# EasyEDA Pro project ProPrj_MN42_2025-04-09.epro, schematic btnBRD
Board Name: btnBRD; Create Date: 2025-04-03; Page Name: btnBRD; Project Name: MN42; Schematic Name: btnBRD; Update Date: 2025-04-05; File: btnBRD; Id: /; Sheet: /
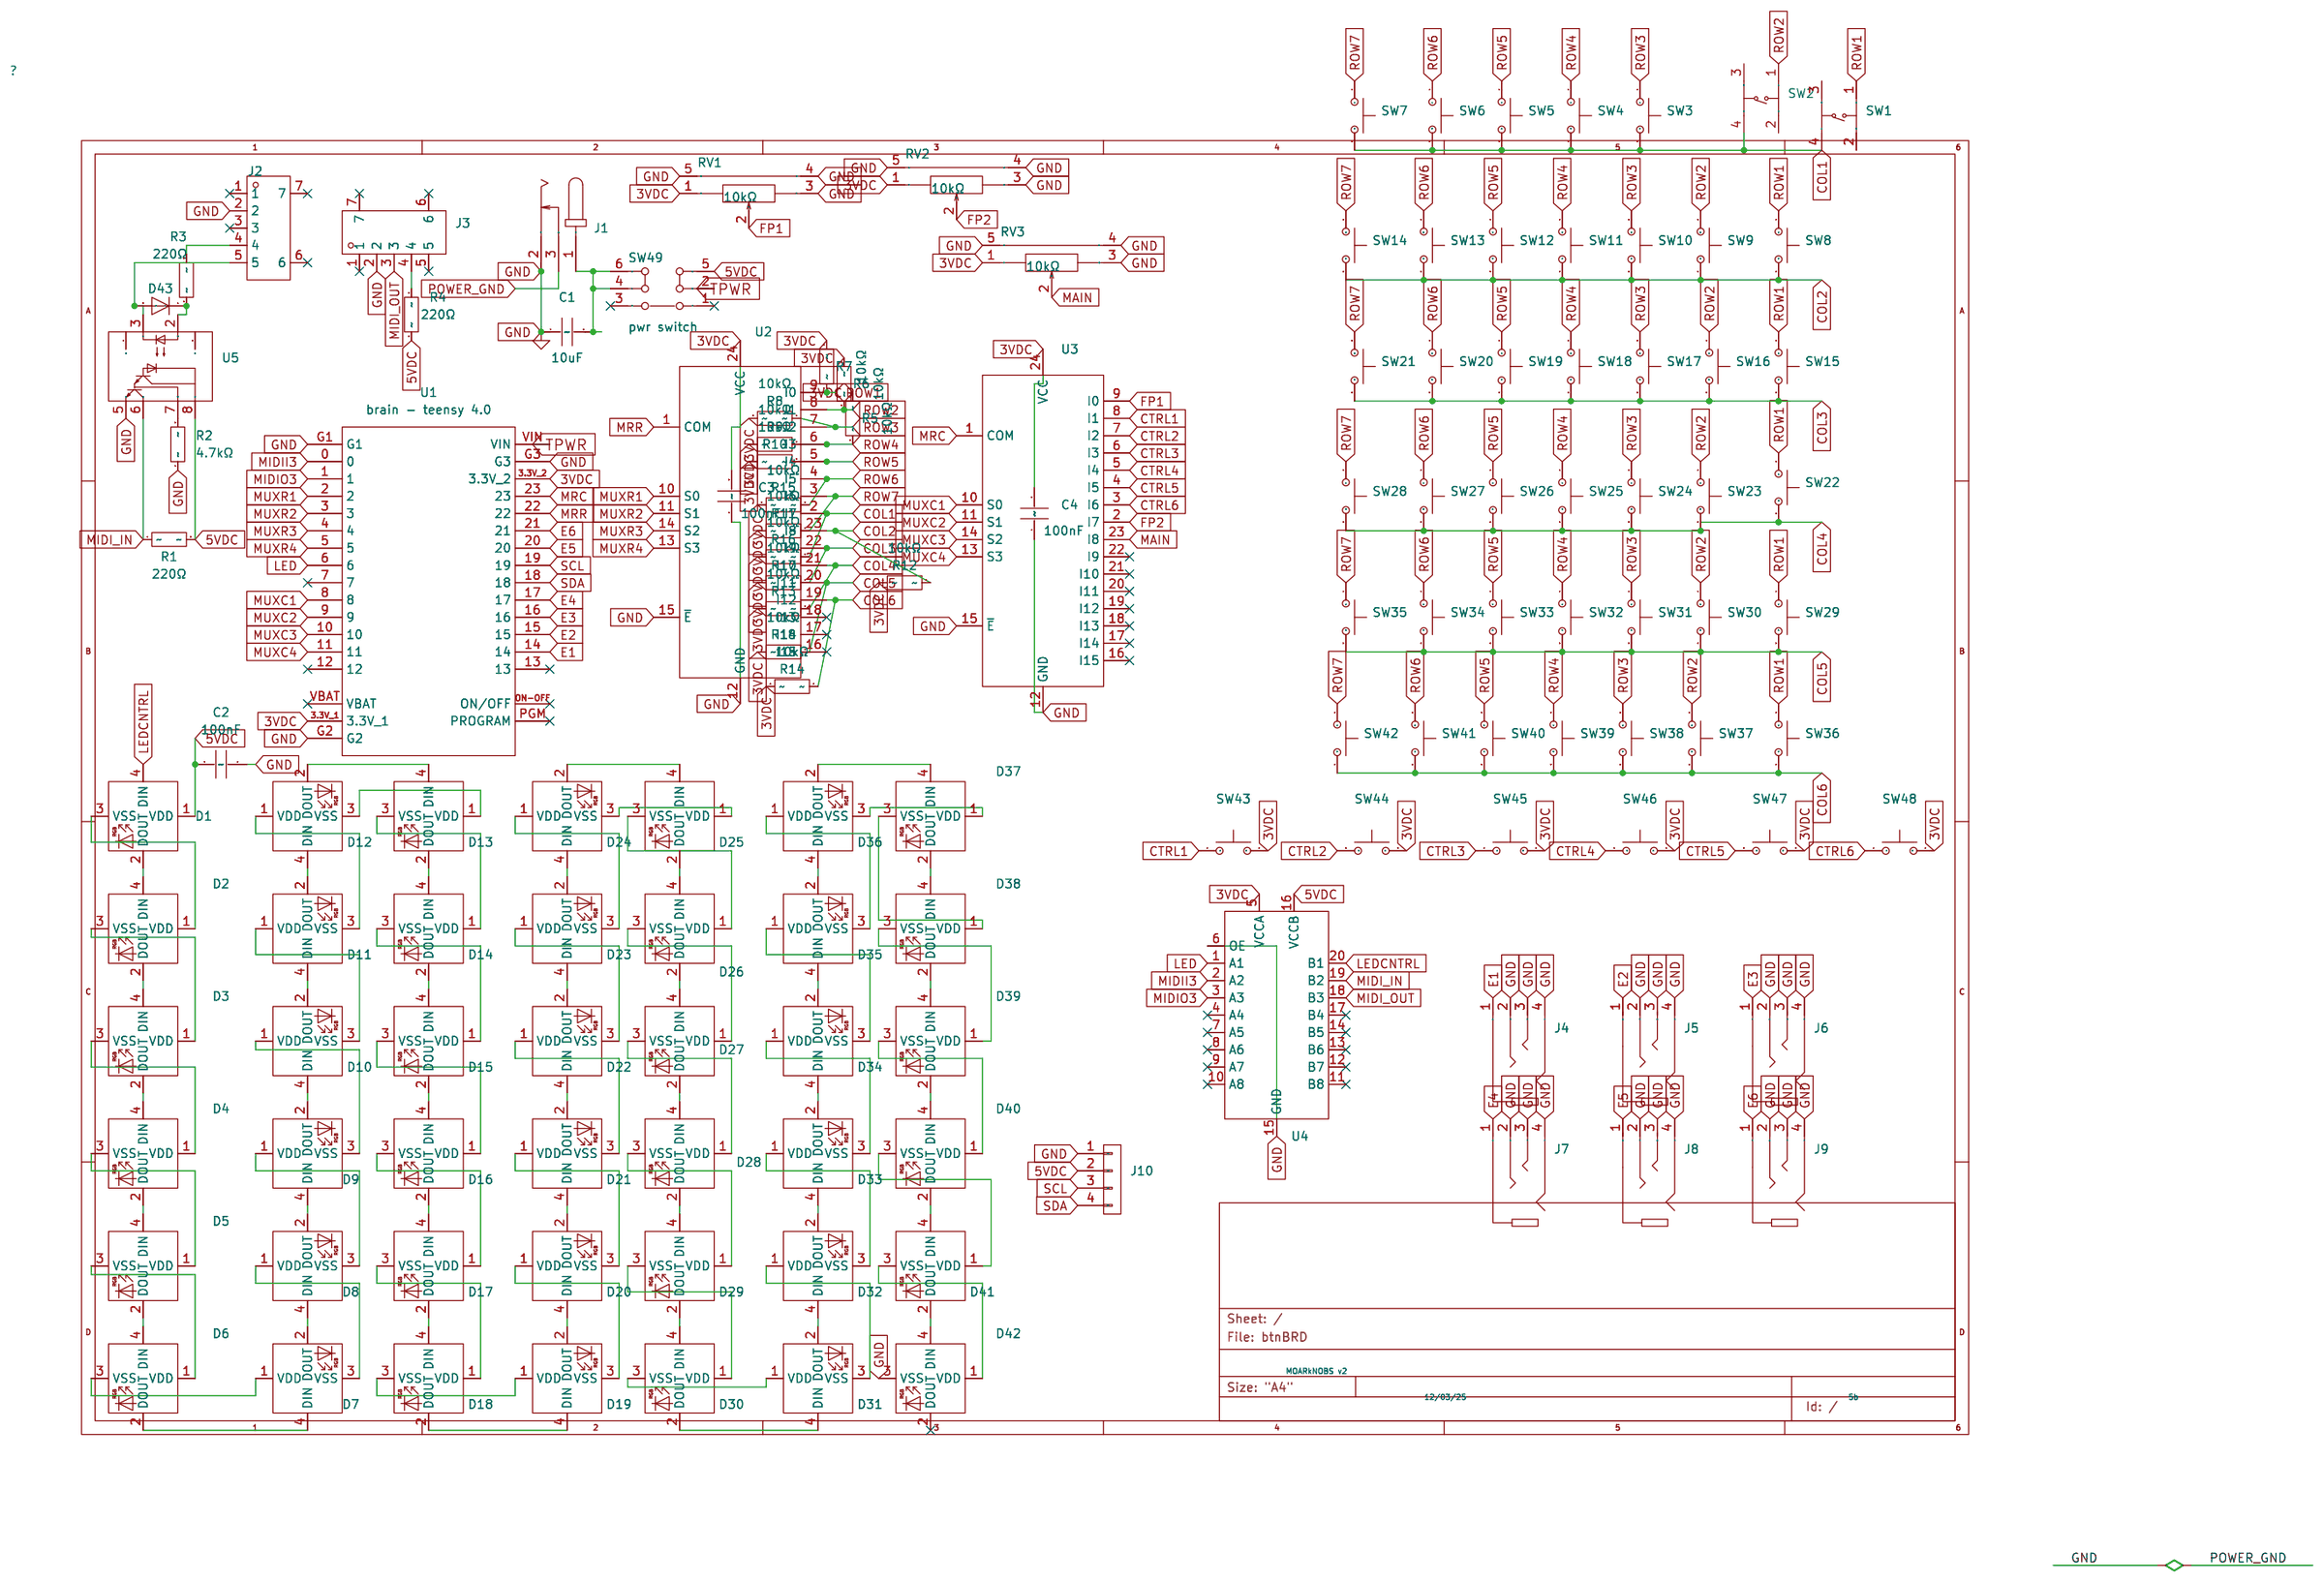
[diagram p0: schematic sheet]

## Parts
C1  10uF  [CAP-TH_L5.5-W3.5-P5.00-D0.5]
C2  100nF  [CAP-TH_L5.0-W4.0-P5.00-D1.0]
C3  100nF  [CAP-TH_L5.0-W4.0-P5.00-D1.0]
C4  100nF  [CAP-TH_L5.0-W4.0-P5.00-D1.0]
D1  XL-5050RGBC-WS2812B  [LED-SMD_4P-L5.0-W5.0-BL_XL-5050RGBC]
D2  XL-5050RGBC-WS2812B  [LED-SMD_4P-L5.0-W5.0-BL_XL-5050RGBC]
D3  XL-5050RGBC-WS2812B  [LED-SMD_4P-L5.0-W5.0-BL_XL-5050RGBC]
D4  XL-5050RGBC-WS2812B  [LED-SMD_4P-L5.0-W5.0-BL_XL-5050RGBC]
D5  XL-5050RGBC-WS2812B  [LED-SMD_4P-L5.0-W5.0-BL_XL-5050RGBC]
D6  XL-5050RGBC-WS2812B  [LED-SMD_4P-L5.0-W5.0-BL_XL-5050RGBC]
D7  XL-5050RGBC-WS2812B  [LED-SMD_4P-L5.0-W5.0-BL_XL-5050RGBC]
D8  XL-5050RGBC-WS2812B  [LED-SMD_4P-L5.0-W5.0-BL_XL-5050RGBC]
D9  XL-5050RGBC-WS2812B  [LED-SMD_4P-L5.0-W5.0-BL_XL-5050RGBC]
D10  XL-5050RGBC-WS2812B  [LED-SMD_4P-L5.0-W5.0-BL_XL-5050RGBC]
D11  XL-5050RGBC-WS2812B  [LED-SMD_4P-L5.0-W5.0-BL_XL-5050RGBC]
D12  XL-5050RGBC-WS2812B  [LED-SMD_4P-L5.0-W5.0-BL_XL-5050RGBC]
D13  XL-5050RGBC-WS2812B  [LED-SMD_4P-L5.0-W5.0-BL_XL-5050RGBC]
D14  XL-5050RGBC-WS2812B  [LED-SMD_4P-L5.0-W5.0-BL_XL-5050RGBC]
D15  XL-5050RGBC-WS2812B  [LED-SMD_4P-L5.0-W5.0-BL_XL-5050RGBC]
D16  XL-5050RGBC-WS2812B  [LED-SMD_4P-L5.0-W5.0-BL_XL-5050RGBC]
D17  XL-5050RGBC-WS2812B  [LED-SMD_4P-L5.0-W5.0-BL_XL-5050RGBC]
D18  XL-5050RGBC-WS2812B  [LED-SMD_4P-L5.0-W5.0-BL_XL-5050RGBC]
D19  XL-5050RGBC-WS2812B  [LED-SMD_4P-L5.0-W5.0-BL_XL-5050RGBC]
D20  XL-5050RGBC-WS2812B  [LED-SMD_4P-L5.0-W5.0-BL_XL-5050RGBC]
D21  XL-5050RGBC-WS2812B  [LED-SMD_4P-L5.0-W5.0-BL_XL-5050RGBC]
D22  XL-5050RGBC-WS2812B  [LED-SMD_4P-L5.0-W5.0-BL_XL-5050RGBC]
D23  XL-5050RGBC-WS2812B  [LED-SMD_4P-L5.0-W5.0-BL_XL-5050RGBC]
D24  XL-5050RGBC-WS2812B  [LED-SMD_4P-L5.0-W5.0-BL_XL-5050RGBC]
D25  XL-5050RGBC-WS2812B  [LED-SMD_4P-L5.0-W5.0-BL_XL-5050RGBC]
D26  XL-5050RGBC-WS2812B  [LED-SMD_4P-L5.0-W5.0-BL_XL-5050RGBC]
D27  XL-5050RGBC-WS2812B  [LED-SMD_4P-L5.0-W5.0-BL_XL-5050RGBC]
D28  XL-5050RGBC-WS2812B  [LED-SMD_4P-L5.0-W5.0-BL_XL-5050RGBC]
D29  XL-5050RGBC-WS2812B  [LED-SMD_4P-L5.0-W5.0-BL_XL-5050RGBC]
D30  XL-5050RGBC-WS2812B  [LED-SMD_4P-L5.0-W5.0-BL_XL-5050RGBC]
D31  XL-5050RGBC-WS2812B  [LED-SMD_4P-L5.0-W5.0-BL_XL-5050RGBC]
D32  XL-5050RGBC-WS2812B  [LED-SMD_4P-L5.0-W5.0-BL_XL-5050RGBC]
D33  XL-5050RGBC-WS2812B  [LED-SMD_4P-L5.0-W5.0-BL_XL-5050RGBC]
D34  XL-5050RGBC-WS2812B  [LED-SMD_4P-L5.0-W5.0-BL_XL-5050RGBC]
D35  XL-5050RGBC-WS2812B  [LED-SMD_4P-L5.0-W5.0-BL_XL-5050RGBC]
D36  XL-5050RGBC-WS2812B  [LED-SMD_4P-L5.0-W5.0-BL_XL-5050RGBC]
D37  XL-5050RGBC-WS2812B  [LED-SMD_4P-L5.0-W5.0-BL_XL-5050RGBC]
D38  XL-5050RGBC-WS2812B  [LED-SMD_4P-L5.0-W5.0-BL_XL-5050RGBC]
D39  XL-5050RGBC-WS2812B  [LED-SMD_4P-L5.0-W5.0-BL_XL-5050RGBC]
D40  XL-5050RGBC-WS2812B  [LED-SMD_4P-L5.0-W5.0-BL_XL-5050RGBC]
D41  XL-5050RGBC-WS2812B  [LED-SMD_4P-L5.0-W5.0-BL_XL-5050RGBC]
D42  XL-5050RGBC-WS2812B  [LED-SMD_4P-L5.0-W5.0-BL_XL-5050RGBC]
D43  1N4148PF  [DO-35_BD1.9-L3.9-P7.90-D0.5-FD]
J1  DC005  [DC-IN-TH_DC005]
J2  DIN-504B-M10  [CONN-TH_DIN-504B-M10]
J3  DIN-504B-M10  [CONN-TH_DIN-504B-M10]
J4  HC-PJ-320A  [AUDIO-SMD_HC-PJ-320A]
J5  HC-PJ-320A  [AUDIO-SMD_HC-PJ-320A]
J6  HC-PJ-320A  [AUDIO-SMD_HC-PJ-320A]
J7  HC-PJ-320A  [AUDIO-SMD_HC-PJ-320A]
J8  HC-PJ-320A  [AUDIO-SMD_HC-PJ-320A]
J9  HC-PJ-320A  [AUDIO-SMD_HC-PJ-320A]
J10  HS96L03W2C03  [OLED-TH_L27.8-W27.2-P2.54_C9900033791]
R1  220Ω  [RES-TH_BD1.7-L3.5-P7.50-D0.5]
R2  4.7kΩ  [RES-TH_BD1.7-L3.5-P7.50-D0.5]
R3  220Ω  [RES-TH_BD1.7-L3.5-P7.50-D0.5]
R4  220Ω  [RES-TH_BD1.7-L3.5-P7.50-D0.5]
R5  10kΩ  [RES-TH_BD1.7-L3.5-P7.50-D0.5]
R6  10kΩ  [RES-TH_BD1.7-L3.5-P7.50-D0.5]
R7  10kΩ  [RES-TH_BD1.7-L3.5-P7.50-D0.5]
R8  10kΩ  [RES-TH_BD1.7-L3.5-P7.50-D0.5]
R9  10kΩ  [RES-TH_BD1.7-L3.5-P7.50-D0.5]
R10  10kΩ  [RES-TH_BD1.7-L3.5-P7.50-D0.5]
R11  10kΩ  [RES-TH_BD1.7-L3.5-P7.50-D0.5]
R12  10kΩ  [RES-TH_BD1.7-L3.5-P7.50-D0.5]
R13  10kΩ  [RES-TH_BD1.7-L3.5-P7.50-D0.5]
R14  10kΩ  [RES-TH_BD1.7-L3.5-P7.50-D0.5]
R15  10kΩ  [RES-TH_BD1.7-L3.5-P7.50-D0.5]
R16  10kΩ  [RES-TH_BD1.7-L3.5-P7.50-D0.5]
R17  10kΩ  [RES-TH_BD1.7-L3.5-P7.50-D0.5]
R18  10kΩ  [RES-TH_BD1.7-L3.5-P7.50-D0.5]
RV1  10kΩ  [RES-ADJ-TH_RK09K1130A5R]
RV2  10kΩ  [RES-ADJ-TH_RK09K1130A5R]
RV3  10kΩ  [RES-ADJ-TH_RK09K1130A5R]
SW1  HX B3F-4055-Y  [SW-TH_4P-L12.0-W12.0-P5.00-LS12.5]
SW2  HX B3F-4055-Y  [SW-TH_4P-L12.0-W12.0-P5.00-LS12.5]
SW3  HX B3F-4055-Y  [SW-TH_4P-L12.0-W12.0-P5.00-LS12.5]
SW4  HX B3F-4055-Y  [SW-TH_4P-L12.0-W12.0-P5.00-LS12.5]
SW5  HX B3F-4055-Y  [SW-TH_4P-L12.0-W12.0-P5.00-LS12.5]
SW6  HX B3F-4055-Y  [SW-TH_4P-L12.0-W12.0-P5.00-LS12.5]
SW7  HX B3F-4055-Y  [SW-TH_4P-L12.0-W12.0-P5.00-LS12.5]
SW8  HX B3F-4055-Y  [SW-TH_4P-L12.0-W12.0-P5.00-LS12.5]
SW9  HX B3F-4055-Y  [SW-TH_4P-L12.0-W12.0-P5.00-LS12.5]
SW10  HX B3F-4055-Y  [SW-TH_4P-L12.0-W12.0-P5.00-LS12.5]
SW11  HX B3F-4055-Y  [SW-TH_4P-L12.0-W12.0-P5.00-LS12.5]
SW12  HX B3F-4055-Y  [SW-TH_4P-L12.0-W12.0-P5.00-LS12.5]
SW13  HX B3F-4055-Y  [SW-TH_4P-L12.0-W12.0-P5.00-LS12.5]
SW14  HX B3F-4055-Y  [SW-TH_4P-L12.0-W12.0-P5.00-LS12.5]
SW15  HX B3F-4055-Y  [SW-TH_4P-L12.0-W12.0-P5.00-LS12.5]
SW16  HX B3F-4055-Y  [SW-TH_4P-L12.0-W12.0-P5.00-LS12.5]
SW17  HX B3F-4055-Y  [SW-TH_4P-L12.0-W12.0-P5.00-LS12.5]
SW18  HX B3F-4055-Y  [SW-TH_4P-L12.0-W12.0-P5.00-LS12.5]
SW19  HX B3F-4055-Y  [SW-TH_4P-L12.0-W12.0-P5.00-LS12.5]
SW20  HX B3F-4055-Y  [SW-TH_4P-L12.0-W12.0-P5.00-LS12.5]
SW21  HX B3F-4055-Y  [SW-TH_4P-L12.0-W12.0-P5.00-LS12.5]
SW22  HX B3F-4055-Y  [SW-TH_4P-L12.0-W12.0-P5.00-LS12.5]
SW23  HX B3F-4055-Y  [SW-TH_4P-L12.0-W12.0-P5.00-LS12.5]
SW24  HX B3F-4055-Y  [SW-TH_4P-L12.0-W12.0-P5.00-LS12.5]
SW25  HX B3F-4055-Y  [SW-TH_4P-L12.0-W12.0-P5.00-LS12.5]
SW26  HX B3F-4055-Y  [SW-TH_4P-L12.0-W12.0-P5.00-LS12.5]
SW27  HX B3F-4055-Y  [SW-TH_4P-L12.0-W12.0-P5.00-LS12.5]
SW28  HX B3F-4055-Y  [SW-TH_4P-L12.0-W12.0-P5.00-LS12.5]
SW29  HX B3F-4055-Y  [SW-TH_4P-L12.0-W12.0-P5.00-LS12.5]
SW30  HX B3F-4055-Y  [SW-TH_4P-L12.0-W12.0-P5.00-LS12.5]
SW31  HX B3F-4055-Y  [SW-TH_4P-L12.0-W12.0-P5.00-LS12.5]
SW32  HX B3F-4055-Y  [SW-TH_4P-L12.0-W12.0-P5.00-LS12.5]
SW33  HX B3F-4055-Y  [SW-TH_4P-L12.0-W12.0-P5.00-LS12.5]
SW34  HX B3F-4055-Y  [SW-TH_4P-L12.0-W12.0-P5.00-LS12.5]
SW35  HX B3F-4055-Y  [SW-TH_4P-L12.0-W12.0-P5.00-LS12.5]
SW36  HX B3F-4055-Y  [SW-TH_4P-L12.0-W12.0-P5.00-LS12.5]
SW37  HX B3F-4055-Y  [SW-TH_4P-L12.0-W12.0-P5.00-LS12.5]
SW38  HX B3F-4055-Y  [SW-TH_4P-L12.0-W12.0-P5.00-LS12.5]
SW39  HX B3F-4055-Y  [SW-TH_4P-L12.0-W12.0-P5.00-LS12.5]
SW40  HX B3F-4055-Y  [SW-TH_4P-L12.0-W12.0-P5.00-LS12.5]
SW41  HX B3F-4055-Y  [SW-TH_4P-L12.0-W12.0-P5.00-LS12.5]
SW42  HX B3F-4055-Y  [SW-TH_4P-L12.0-W12.0-P5.00-LS12.5]
SW43  HX B3F-4055-Y  [SW-TH_4P-L12.0-W12.0-P5.00-LS12.5]
SW44  HX B3F-4055-Y  [SW-TH_4P-L12.0-W12.0-P5.00-LS12.5]
SW45  HX B3F-4055-Y  [SW-TH_4P-L12.0-W12.0-P5.00-LS12.5]
SW46  HX B3F-4055-Y  [SW-TH_4P-L12.0-W12.0-P5.00-LS12.5]
SW47  HX B3F-4055-Y  [SW-TH_4P-L12.0-W12.0-P5.00-LS12.5]
SW48  HX B3F-4055-Y  [SW-TH_4P-L12.0-W12.0-P5.00-LS12.5]
SW49  pwr switch  [SW-TH_TK-6580A-1]
U1  brain - teensy 4.0  [teensy 4.0:MODULE_DEV-15583]
U2  CD74HC4067M96  [SOIC-24_L15.4-W7.5-P1.27-LS10.3-BL]
U3  CD74HC4067M96  [SOIC-24_L15.4-W7.5-P1.27-LS10.3-BL]
U4  TXB0108DQSR  [SON-20_L4.0-W2.0-P0.40-BL]
U5  6N138  [DIP-8_L9.8-W6.6-P2.54-LS7.6-BL]

## Library data of the parts
C1 = FG26X7R1E106KRT06: Capacitance: Tolerance:±10% Tolerance:±10% Voltage Rated: Temperature Coefficient:; LCSC Part Name: 10uF ±10% 25V; Supplier Part: C531341; Manufacturer: TDK; Supplier Footprint: 插件,P=5mm; JLCPCB Part Class: Extended Part; Datasheet: https://atta.szlcsc.com/upload/public/pdf/source/20210603/7C07ADBE9CEF1AEE8735D13453ED6990.pdf; Supplier: LCSC; Tolerance: ±10%
C2-C4 = CT4G-0805-2X1-63V-0.1μF-K: Capacitance:100nF Tolerance:±10% Tolerance:±10% Voltage Rating:63V Temperature Coefficient:-; LCSC Part Name: 100nF ±10% 63V; Supplier Part: C400087; Manufacturer: TORCH(火炬); Supplier Footprint: 插件,P=5.08mm; JLCPCB Part Class: Extended Part; Datasheet: https://atta.szlcsc.com/upload/public/pdf/source/20191118/C454433_59D9A4E5EF49F2CA9CCAEF3FF757A9ED.pdf; Supplier: LCSC; Tolerance: ±10%; Voltage Rating: 63V
D1-D42 = XL-5050RGBC-WS2812B: Supplier Part: C2843785; Manufacturer: XINGLIGHT(成兴光); Supplier Footprint: SMD5050; JLCPCB Part Class: Extended Part; Datasheet: https://atta.szlcsc.com/upload/public/pdf/source/20240412/E1004CAA80592E31D08BFE019083806F.pdf; Supplier: LCSC
D43 = 1N4148PF: Supplier Part: C2992430; Manufacturer: ST(先科); Supplier Footprint: DO-35; JLCPCB Part Class: Extended Part; Datasheet: https://atta.szlcsc.com/upload/public/pdf/source/20220414/133B43E450E13E2641A7D12D66654211.pdf; Supplier: LCSC
J1 = DC005: Connector Type:DC Power Receptacle Mounting Style:Bend-in Inside Contact Diameter:2mm Outside Contact Diameter:6.3mm Current Rating (Max):500mA Voltage Rating (Max):30V Operating Temperature Range:-25℃~+70℃ Operating Temperature Range:-25℃~+70℃; LCSC Part Name: DC电源插座 内径:2mm 外径:6.3mm; Supplier Part: C431533; Manufacturer: SHOU HAN(首韩); Supplier Footprint: 插件; JLCPCB Part Class: Extended Part; Datasheet: https://atta.szlcsc.com/upload/public/pdf/source/20190925/C431533_4751811035784AC1D38EBC85F7905E99.pdf; Supplier: LCSC; Connector Type: DC Power Receptacle; Mounting Style: Bend-in; Inside Contact Diameter: 2mm; Outside Contact Diameter: 6.3mm; Current Rating (Max): 500mA; Voltage Rating (Max): 30V; Operating Temperature Range: -25℃~+70℃
J2 J3 = DIN-504B-M10: Supplier Part: C2939346; Manufacturer: HOOYA(皓宇电子); Supplier Footprint: 插件; JLCPCB Part Class: Extended Part; Datasheet: https://atta.szlcsc.com/upload/public/pdf/source/20220120/ABB2570656C6359DBC61E5C1017AC323.pdf; Supplier: LCSC
J4-J9 = HC-PJ-320A: Connector Type:3.5mm Headphone Jack Current Rating:500mA Voltage Rating (Max):30V Contact Material:Copper Contact Plating:Nickel Operating Temperature:-25℃~+70℃ Operating Temperature:-25℃~+70℃; LCSC Part Name: 黑色 3.5mm耳机座 PJ-320A 插件黑色; Supplier Part: C7501806; Manufacturer: HC(虹成电子); Supplier Footprint: 插件; JLCPCB Part Class: Extended Part; Datasheet: https://atta.szlcsc.com/upload/public/pdf/source/20250106/7D33987A36C8C755DD3F52F3C7FA5722.pdf; Supplier: LCSC; Connector Type: 3.5mm Headphone Jack; Current Rating: 500mA; Voltage Rating (Max): 30V; Contact Material: Copper; Contact Plating: Nickel; Operating Temperature: -25℃~+70℃
J10 = HS96L03W2C03: Main Control Chip:SSD1315 Interface Type:I2C Size:0.96 Pixel Resolution:128x64 Operating Temperature:-40℃~+70℃ Operating Temperature:-40℃~+70℃; LCSC Part Name: 0.96寸OLED显示屏窄白光IIC; Supplier Part: C5248080; Manufacturer: HS(汉昇); JLCPCB Part Class: Extended Part; Datasheet: https://atta.szlcsc.com/upload/public/pdf/source/20230627/763D01F79A90007632F098068C7C8AD9.pdf; Supplier: LCSC; Main Control Chip: SSD1315; Interface Type: I2C; Size: 0.96; Pixel Resolution: 128x64; Operating Temperature: -40℃~+70℃
R1 R3 R4 = RN 1/8W 220R F T/B A1: Type:Metal Film Resistors Resistance: Tolerance:±1% Tolerance:±1% Overload Voltage (Max):150V Power(Watts):125mW Temperature Coefficient:±50ppm/℃ Temperature Coefficient:±50ppm/℃ Operating Temperature Range:-55℃~+125℃ Operating Temperature Range:-55℃~+125; LCSC Part Name: 220Ω ±1% 125mW 金属膜电阻; Supplier Part: C433487; Manufacturer: Tyohm(幸亚电阻); Supplier Footprint: 插件,D1.7xL3.5mm; JLCPCB Part Class: Extended Part; Datasheet: https://atta.szlcsc.com/upload/public/pdf/source/20191008/C433681_B72693A7FD256E0D1DC5EFE3F095EED3.pdf; Supplier: LCSC; Type: Metal Film Resistors; Tolerance: ±1%; Overload Voltage (Max): 150V; Power(Watts): 125mW; Temperature Coefficient: ±50ppm/℃; Operating Temperature Range: -55℃~+125℃
R2 = RN 1/8W 4K7 F T/B A1: Type:Metal Film Resistors Resistance: Tolerance:±1% Tolerance:±1% Overload Voltage (Max):150V Power(Watts):125mW Temperature Coefficient:±50ppm/℃ Temperature Coefficient:±50ppm/℃ Operating Temperature Range:-55℃~+125℃ Operating Temperature Range:-55℃~+125; LCSC Part Name: 4.7kΩ ±1% 125mW 金属膜电阻; Supplier Part: C433477; Manufacturer: Tyohm(幸亚电阻); Supplier Footprint: 插件,D1.7xL3.5mm; JLCPCB Part Class: Extended Part; Datasheet: https://atta.szlcsc.com/upload/public/pdf/source/20191008/C433681_B72693A7FD256E0D1DC5EFE3F095EED3.pdf; Supplier: LCSC; Type: Metal Film Resistors; Tolerance: ±1%; Overload Voltage (Max): 150V; Power(Watts): 125mW; Temperature Coefficient: ±50ppm/℃; Operating Temperature Range: -55℃~+125℃
R5-R18 = RN1/8W10KFT/BA1: Type:Metal Film Resistors Resistance: Tolerance:±1% Tolerance:±1% Overload Voltage (Max):150V Power(Watts):125mW Temperature Coefficient:±50ppm/℃ Temperature Coefficient:±50ppm/℃ Operating Temperature Range:-55℃~+125℃ Operating Temperature Range:-55℃~+125; LCSC Part Name: 10kΩ ±1% 125mW 金属膜电阻; Supplier Part: C433502; Manufacturer: Tyohm(幸亚电阻); Supplier Footprint: 插件,D1.7xL3.5mm; JLCPCB Part Class: Extended Part; Datasheet: https://atta.szlcsc.com/upload/public/pdf/source/20191008/C433681_B72693A7FD256E0D1DC5EFE3F095EED3.pdf; Supplier: LCSC; Type: Metal Film Resistors; Tolerance: ±1%; Overload Voltage (Max): 150V; Power(Watts): 125mW; Temperature Coefficient: ±50ppm/℃; Operating Temperature Range: -55℃~+125℃
RV1-RV3 = RK09K1130A5R: Resistance: Tolerance:±20% Tolerance:±20%; LCSC Part Name: 10kΩ ±20%; Supplier Part: C209779; Manufacturer: ALPSALPINE(阿尔卑斯阿尔派); Supplier Footprint: 插件; JLCPCB Part Class: Extended Part; Datasheet: https://atta.szlcsc.com/upload/public/pdf/source/20180404/C209779_144B5EF41D1B8507FF4660D0445AF581.pdf; Supplier: LCSC; Tolerance: ±20%
SW1-SW48 = HX B3F-4055-Y: Actuator Style:Square Plunger Operating Force:2.5N Mounting Type:Direct Insert Length:11.8mm Width:11.8mm Switch Height:7.3mm Strike Gundam:- Contact Current:50mA Voltage Rating:12V Actuator/Cap Color:Yellow With Lamp:None IP Rating:- Termination Style:PC; LCSC Part Name: 12*12*7.3mm 直插 轻触开关; Supplier Part: C36498965; Manufacturer: hanxia(韩下); Supplier Footprint: DIP,12x12mm; JLCPCB Part Class: Extended Part; Datasheet: https://atta.szlcsc.com/upload/public/pdf/source/20241121/FA8A3B5FC41001412F2E47168C08B6C2.pdf; Supplier: LCSC; Actuator Style: Square Plunger; Operating Force: 2.5N; Mounting Type: Direct Insert; Length: 11.8mm; Width: 11.8mm; Switch Height: 7.3mm; Contact Current: 50mA; Voltage Rating: 12V; Actuator/Cap Color: Yellow; With Lamp: None; Termination Style: PCPin; Life: 100,000 Times; Operating Temperature: -25℃~+85℃
SW49 = TK-6580A-1: Circuit:DPDT Self Lock / No Lock:LATCHING Actuator Style:Projected Plunger Mounting Style:Lying Actuator/Cap Color:White Pin Style:PCPin Operating Force:250gf Mechanical Life:-; LCSC Part Name: 自锁开关5.8*5.8*9.9有声有锁插件六脚DIP按键开关带锁6P脚; Supplier Part: C528770; Manufacturer: Yuandi(元迪); Supplier Footprint: 插件; JLCPCB Part Class: Extended Part; Datasheet: https://atta.szlcsc.com/upload/public/pdf/source/20200831/C528770_3D9C55C6A36B9A979586F85D435EB40C.pdf; Supplier: LCSC; Circuit: DPDT; Self Lock / No Lock: LATCHING; Actuator Style: Projected Plunger; Mounting Style: Lying; Actuator/Cap Color: White; Pin Style: PCPin; Operating Force: 250gf
U1 = teensy40_DEV-15583: STANDARD: Manufacturer Recommendations; MAXIMUM_PACKAGE_HEIGHT: 5.87mm; MANUFACTURER: Sparkfun
U2 U3 = CD74HC4067M96: Switch Circuit:- Number of Channels:16 Supply Voltage:2V~6V Supply Voltage:2V~6V Turn-on time:83ns On-State Resistance (Max):200Ω Turn-off time:83ns Operating Temperature:-55℃~+125℃ Operating Temperature:-55℃~+125℃; LCSC Part Name: 高速CMOS逻辑16通道模拟多路复用器/解复用器; Supplier Part: C496123; Manufacturer: TI(德州仪器); Supplier Footprint: SOIC-24-300mil; JLCPCB Part Class: Extended Part; Datasheet: https://www.ti.com/cn/lit/gpn/cd74hc4067; Supplier: LCSC; Number of Channels: 16; Supply Voltage: 2V~6V; Turn-on time: 83ns; On-State Resistance (Max): 200Ω; Turn-off time: 83ns; Operating Temperature: -55℃~+125℃
U4 = TXB0108DQSR: Supplier Part: C427057; Manufacturer: TI(德州仪器); Supplier Footprint: SON-20(2x4); JLCPCB Part Class: Extended Part; Datasheet: https://www.ti.com/cn/lit/gpn/txb0108; Supplier: LCSC
U5 = 6N138: Input Type:DC Supply Voltage:- Supply Voltage:- Isolation Voltage(rms):5kV Common Mode Transient Immunity (CMTI):1kV/us Number of Channels:1 Operating Temperature:-55℃~+85℃ Operating Temperature:-55℃~+85℃; LCSC Part Name: DC输入 1通道 隔离电压(rms):5000V; Supplier Part: C255743; Manufacturer: ISOCOM(英国安数光); Supplier Footprint: DIP-8; JLCPCB Part Class: Extended Part; Datasheet: https://atta.szlcsc.com/upload/public/pdf/source/20180822/C255747_0DE46B44EFBF5BF2F7E9C825E24779A2.pdf; Supplier: LCSC; Input Type: DC; Isolation Voltage(rms): 5kV; Common Mode Transient Immunity (CMTI): 1kV/us; Number of Channels: 1; Operating Temperature: -55℃~+85℃

## Nets
3VDC: C3.2 C4.2 R5.2 R6.2 R7.2 R8.2 R9.2 R10.2 R11.2 R12.2 R13.2 R14.2 R15.2 R16.2 R17.2 R18.2 RV1.1 RV2.1 RV3.1 SW43.2 SW44.2 SW45.2 SW46.2 SW47.2 SW48.2 U1.3.3V_1 U1.3.3V_2 U2.24(VCC) U3.24(VCC) U4.5(VCCA)
5VDC: C2.1 D1.1(VDD) J10.2(Pin) R1.2 R4.1 SW49.5 U4.16(VCCB) U5.8(VCC)
GND: C1.1 C2.2 C3.1 C4.1 D42.3(VSS) J1.2 J1.3 J2.2 J3.2 J4.2 J4.3 J4.4 J5.2 J5.3 J5.4 J6.2 J6.3 J6.4 J7.2 J7.3 J7.4 J8.2 J8.3 J8.4 J9.2 J9.3 J9.4 J10.1(Pin) R2.1 RV1.3 RV1.4(EH) RV1.5(EH) RV2.3 RV2.4(EH) RV2.5(EH) RV3.3 RV3.4(EH) RV3.5(EH) U1.G1 U1.G2 U1.G3 U2.12(GND) U2.15(~{E}) U3.12(GND) U3.15(~{E}) U4.6(OE) U4.15(GND) U5.5(GND)
COL1: R16.1 SW1.4 SW2.4 SW3.2 SW4.2 SW5.2 SW6.2 SW7.2 U2.2(I7)
COL2: R12.1 SW8.2 SW9.2 SW10.2 SW11.2 SW12.2 SW13.2 SW14.2 U2.23(I8)
COL3: R17.1 SW15.2 SW16.2 SW17.2 SW18.2 SW19.2 SW20.2 SW21.2 U2.22(I9)
COL4: R13.1 SW22.2 SW23.2 SW24.2 SW25.2 SW26.2 SW27.2 SW28.2 U2.21(I10)
COL5: R18.1 SW29.2 SW30.2 SW31.2 SW32.2 SW33.2 SW34.2 SW35.2 U2.20(I11)
COL6: R14.1 SW36.2 SW37.2 SW38.2 SW39.2 SW40.2 SW41.2 SW42.2 U2.19(I12)
CTRL1: SW43.1 U3.8(I1)
CTRL2: SW44.1 U3.7(I2)
CTRL3: SW45.1 U3.6(I3)
CTRL4: SW46.1 U3.5(I4)
CTRL5: SW47.1 U3.4(I5)
CTRL6: SW48.1 U3.3(I6)
E1: J4.1 U1.14
E2: J5.1 U1.15
E3: J6.1 U1.16
E4: J7.1 U1.17
E5: J8.1 U1.20
E6: J9.1 U1.21
FP1: RV1.2 U3.9(I0)
FP2: RV2.2 U3.2(I7)
LED: U1.6 U4.1(A1)
LEDCNTRL: D1.4(DIN) U4.20(B1)
MAIN: RV3.2 U3.23(I8)
MIDI_IN: R1.1 U4.19(B2) U5.6(VO2)
MIDI_OUT: J3.3 U4.18(B3)
MIDII3: U1.0 U4.2(A2)
MIDIO3: U1.1 U4.3(A3)
MRC: U1.23 U3.1(COM)
MRR: U1.22 U2.1(COM)
MUXC1: U1.8 U3.10(S0)
MUXC2: U1.9 U3.11(S1)
MUXC3: U1.10 U3.14(S2)
MUXC4: U1.11 U3.13(S3)
MUXR1: U1.2 U2.10(S0)
MUXR2: U1.3 U2.11(S1)
MUXR3: U1.4 U2.14(S2)
MUXR4: U1.5 U2.13(S3)
ROW1: R7.1 SW1.1 SW8.1 SW15.1 SW22.1 SW29.1 SW36.1 U2.9(I0)
ROW2: R6.1 SW2.1 SW9.1 SW16.1 SW23.1 SW30.1 SW37.1 U2.8(I1)
ROW3: R8.1 SW3.1 SW10.1 SW17.1 SW24.1 SW31.1 SW38.1 U2.7(I2)
ROW4: R5.1 R9.1 SW4.1 SW11.1 SW18.1 SW25.1 SW32.1 SW39.1 U2.6(I3)
ROW5: R10.1 SW5.1 SW12.1 SW19.1 SW26.1 SW33.1 SW40.1 U2.5(I4)
ROW6: R15.1 SW6.1 SW13.1 SW20.1 SW27.1 SW34.1 SW41.1 U2.4(I5)
ROW7: R11.1 SW7.1 SW14.1 SW21.1 SW28.1 SW35.1 SW42.1 U2.3(I6)
SCL: J10.3(Pin) U1.19
SDA: J10.4(Pin) U1.18
TPWR: SW49.2 U1.VIN
$1N1: D35.2(DOUT) D36.4(DIN)
$1N4: D15.2(DOUT) D16.4(DIN)
$1N5: D26.3(VSS) D27.1(VDD)
$1N6: D43.1(K) R3.1 U5.2(C1)
$1N7: D29.3(VSS) D30.1(VDD)
$1N8: D4.3(VSS) D5.1(VDD)
$1N11: D23.3(VSS) D24.1(VDD)
$1N12: D3.3(VSS) D4.1(VDD)
$1N13: D22.2(DOUT) D23.4(DIN)
$1N15: D36.3(VSS) D37.1(VDD)
$1N17: D11.3(VSS) D12.1(VDD)
$1N19: D31.3(VSS) D32.1(VDD)
$1N20: D18.3(VSS) D19.1(VDD)
$1N23: D34.2(DOUT) D35.4(DIN)
$1N24: J3.4 R4.2
$1N25: D10.3(VSS) D11.1(VDD)
$1N26: D20.3(VSS) D21.1(VDD)
$1N27: D38.3(VSS) D39.1(VDD)
$1N29: D17.3(VSS) D18.1(VDD)
$1N30: D7.3(VSS) D8.1(VDD)
$1N31: D9.3(VSS) D10.1(VDD)
$1N32: D13.2(DOUT) D14.4(DIN)
$1N33: D32.3(VSS) D33.1(VDD)
$1N34: D15.3(VSS) D16.1(VDD)
$1N37: D5.3(VSS) D6.1(VDD)
$1N38: D19.2(DOUT) D20.4(DIN)
$1N39: D20.2(DOUT) D21.4(DIN)
$1N40: D35.3(VSS) D36.1(VDD)
$1N43: D24.3(VSS) D25.1(VDD)
$1N45: D21.2(DOUT) D22.4(DIN)
$1N46: D32.2(DOUT) D33.4(DIN)
$1N51: D12.2(DOUT) D13.4(DIN)
$1N54: D6.3(VSS) D7.1(VDD)
$1N56: D14.2(DOUT) D15.4(DIN)
$1N57: D36.2(DOUT) D37.4(DIN)
$1N58: D8.3(VSS) D9.1(VDD)
$1N59: D40.3(VSS) D41.1(VDD)
$1N60: D13.3(VSS) D14.1(VDD)
$1N61: D7.2(DOUT) D8.4(DIN)
$1N62: D33.3(VSS) D34.1(VDD)
$1N63: D41.3(VSS) D42.1(VDD)
$1N64: D25.3(VSS) D26.1(VDD)
$1N65: D30.3(VSS) D31.1(VDD)
$1N66: D33.2(DOUT) D34.4(DIN)
$1N68: D16.3(VSS) D17.1(VDD)
$1N70: D21.3(VSS) D22.1(VDD)
$1N71: D2.3(VSS) D3.1(VDD)
$1N74: D1.3(VSS) D2.1(VDD)
$1N75: D31.2(DOUT) D32.4(DIN)
$1N78: D2.2(DOUT) D3.4(DIN)
$1N79: D27.3(VSS) D28.1(VDD)
$1N82: D34.3(VSS) D35.1(VDD)
$1N90: D28.2(DOUT) D29.4(DIN)
$1N92: D19.3(VSS) D20.1(VDD)
$1N93: D17.2(DOUT) D18.4(DIN)
$1N94: D25.2(DOUT) D26.4(DIN)
$1N96: D37.3(VSS) D38.1(VDD)
$1N97: D43.2(A) J2.5 U5.3(C2)
$1N107: D22.3(VSS) D23.1(VDD)
$1N108: D39.3(VSS) D40.1(VDD)
$1N112: D3.2(DOUT) D4.4(DIN)
$1N121: D26.2(DOUT) D27.4(DIN)
$1N122: C1.2 J1.1 SW49.4 SW49.6
$1N123: D12.3(VSS) D13.1(VDD)
$1N124: D4.2(DOUT) D5.4(DIN)
$1N125: D29.2(DOUT) D30.4(DIN)
$1N126: D39.2(DOUT) D40.4(DIN)
$1N127: D18.2(DOUT) D19.4(DIN)
$1N128: D5.2(DOUT) D6.4(DIN)
$1N131: D11.2(DOUT) D12.4(DIN)
$1N132: D14.3(VSS) D15.1(VDD)
$1N133: D23.2(DOUT) D24.4(DIN)
$1N134: D30.2(DOUT) D31.4(DIN)
$1N136: D27.2(DOUT) D28.4(DIN)
$1N138: D28.3(VSS) D29.1(VDD)
$1N139: D8.2(DOUT) D9.4(DIN)
$1N141: D6.2(DOUT) D7.4(DIN)
$1N142: D37.2(DOUT) D38.4(DIN)
$1N144: D41.2(DOUT) D42.4(DIN)
$1N145: D40.2(DOUT) D41.4(DIN)
$1N146: D16.2(DOUT) D17.4(DIN)
$1N147: D1.2(DOUT) D2.4(DIN)
$1N148: D9.2(DOUT) D10.4(DIN)
$1N149: D38.2(DOUT) D39.4(DIN)
$1N151: D10.2(DOUT) D11.4(DIN)
$1N152: D24.2(DOUT) D25.4(DIN)
$1N2399: R2.2 U5.7(VO1)
$1N19678: J2.4 R3.2

Not connected (* = marked no-connect by the designer): D42 2(DOUT)*; J2 1* 3* 6* 7*; J3 1* 5* 6* 7*; SW1 2 3; SW2 2 3; SW49 1* 3*; U1 7* 12* 13* ON-OFF(ON/OFF)* PGM(PROGRAM)* VBAT*; U2 16(I15)* 17(I14)* 18(I13)*; U3 16(I15)* 17(I14)* 18(I13)* 19(I12)* 20(I11)* 21(I10)* 22(I9)*; U4 4(A4)* 7(A5)* 8(A6)* 9(A7)* 10(A8)* 11(B8)* 12(B7)* 13(B6)* 14(B5)* 17(B4)*; U5 1(NC) 4(NC)

## Notes on the sheet
- MOARkNOBS v2
- 12/03/25
- 5b
